# EAGLE schematic Power_grad (EAGLE 9.6.2)
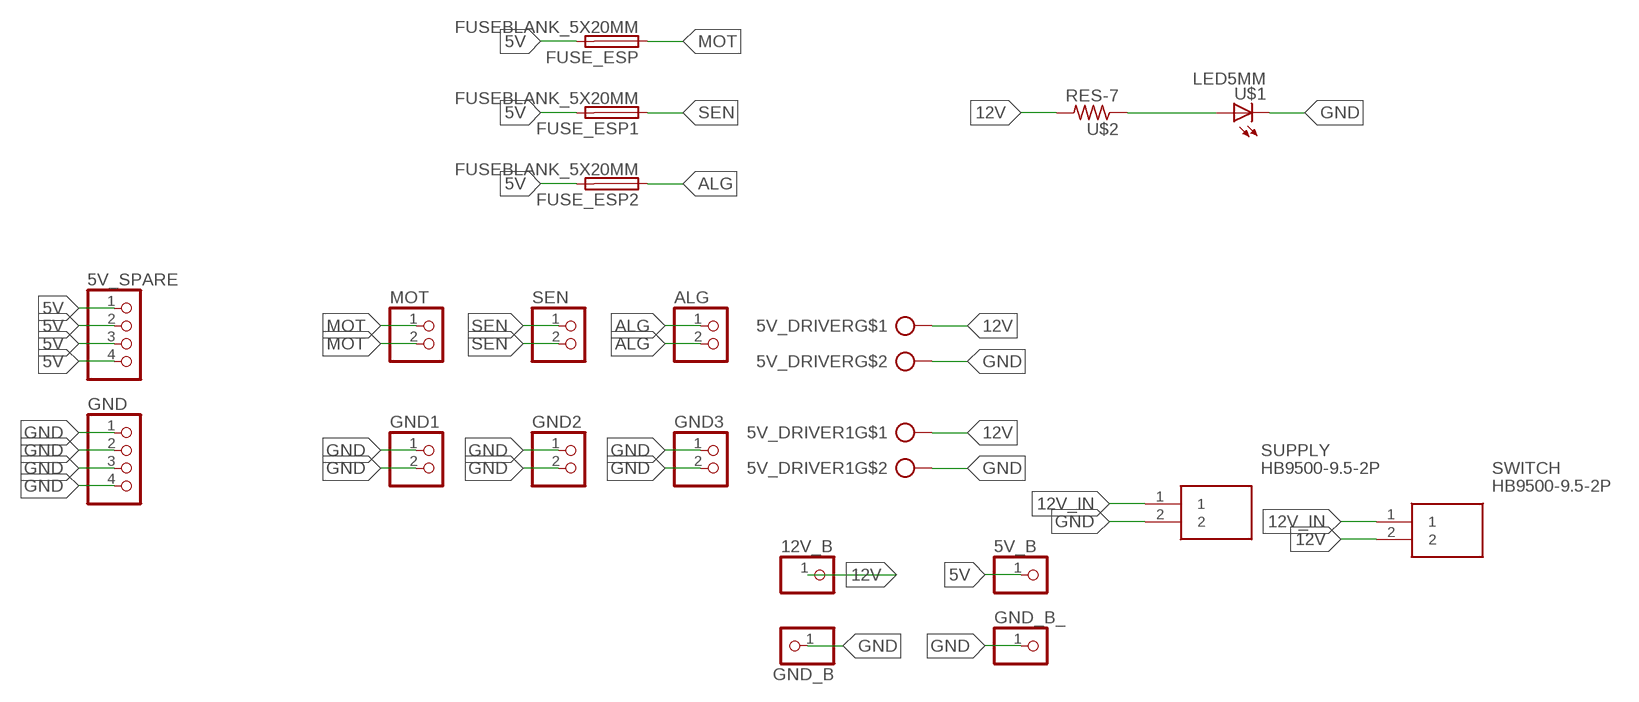
[diagram p0: schematic, sheet 1]

## Parts
5V_B  PINHD-1X1  [1X01]
5V_DRIVER  CON_PTR_2  [AK300/2]
5V_DRIVER1  CON_PTR_2  [AK300/2]
5V_SPARE  PINHD-1X4  [1X04]
12V_B  PINHD-1X1  [1X01]
ALG  PINHD-2_DATA  [1X02_DATA]
FUSE_ESP  FUSEBLANK_5X20MM  [FUSE_HOLDER_5X20MM]
FUSE_ESP1  FUSEBLANK_5X20MM  [FUSE_HOLDER_5X20MM]
FUSE_ESP2  FUSEBLANK_5X20MM  [FUSE_HOLDER_5X20MM]
GND  PINHD-1X4  [1X04]
GND1  PINHD-2_DATA  [1X02_DATA]
GND2  PINHD-2_DATA  [1X02_DATA]
GND3  PINHD-2_DATA  [1X02_DATA]
GND_B  PINHD-1X1  [1X01]
GND_B_  PINHD-1X1  [1X01]
MOT  PINHD-2_DATA  [1X02_DATA]
SEN  PINHD-2_DATA  [1X02_DATA]
SUPPLY  HB9500-9.5-2P  [SHDR2W140P0X950_1X2_2055X1800X]
SWITCH  HB9500-9.5-2P  [SHDR2W140P0X950_1X2_2055X1800X]
U$1  LED5MM  [LED5MM]
U$2  RES-7  [0204/7]

## Nets
5V: 5V_B.1 5V_SPARE.1 5V_SPARE.2 5V_SPARE.3 5V_SPARE.4 FUSE_ESP1.2 FUSE_ESP2.2 FUSE_ESP.2
12V: 5V_DRIVER1.1 5V_DRIVER.1 12V_B.1 SWITCH.2 U$2.2
12V_IN: SUPPLY.1 SWITCH.1
ALG: ALG.1 ALG.2 FUSE_ESP2.1
GND: 5V_DRIVER1.2 5V_DRIVER.2 GND1.1 GND1.2 GND2.1 GND2.2 GND3.1 GND3.2 GND.1 GND.2 GND.3 GND.4 GND_B.1 GND_B_.1 SUPPLY.2 U$1.K(C)
MOT: FUSE_ESP.1 MOT.1 MOT.2
N$1: U$1.A U$2.1
SEN: FUSE_ESP1.1 SEN.1 SEN.2

## Library data of the parts
5V_B 12V_B GND_B GND_B_ = ALL:PINHD-1X1: PIN HEADER
5V_DRIVER 5V_DRIVER1 = ALL:CON_PTR_2
5V_SPARE GND = ALL:PINHD-1X4: PIN HEADER
ALG GND1-GND3 MOT SEN = ALL:PINHD-2_DATA: PIN HEADER
FUSE_ESP FUSE_ESP1 FUSE_ESP2 = fuse:FUSE: Fuse; OC_FARNELL: unknown; OC_NEWARK: unknown
SUPPLY SWITCH = HB9500-9.5-2P:HB9500-9.5-2P: Barrier Block 2 2 0.374"(9.50mm) 12-22 AWG P=9.5mm Barrier Terminal Blocks Source: Datasheet <https://datasheet.lcsc.com/szlcsc/Ningbo-Kangnex-Elec-Ningbo-Kangnex-Elec-HB9500-2P-black_C60785.pdf>; DESCRIPTION: Barrier Block 2 2 0.374"(9.50mm) 12-22 AWG P=9.5mm Barrier Terminal Blocks; HEIGHT: 14.4mm; MANUFACTURER_NAME: Ningbo Kangnex; MANUFACTURER_PART_NUMBER: HB9500-9.5-2P
U$1 = ALL:LED5MM
U$2 = ALL:RES-7